# Altium schematic sheet Sch_Design_Check_List.SchDoc
size A4; SheetNumber: 11; SheetTotal: 10
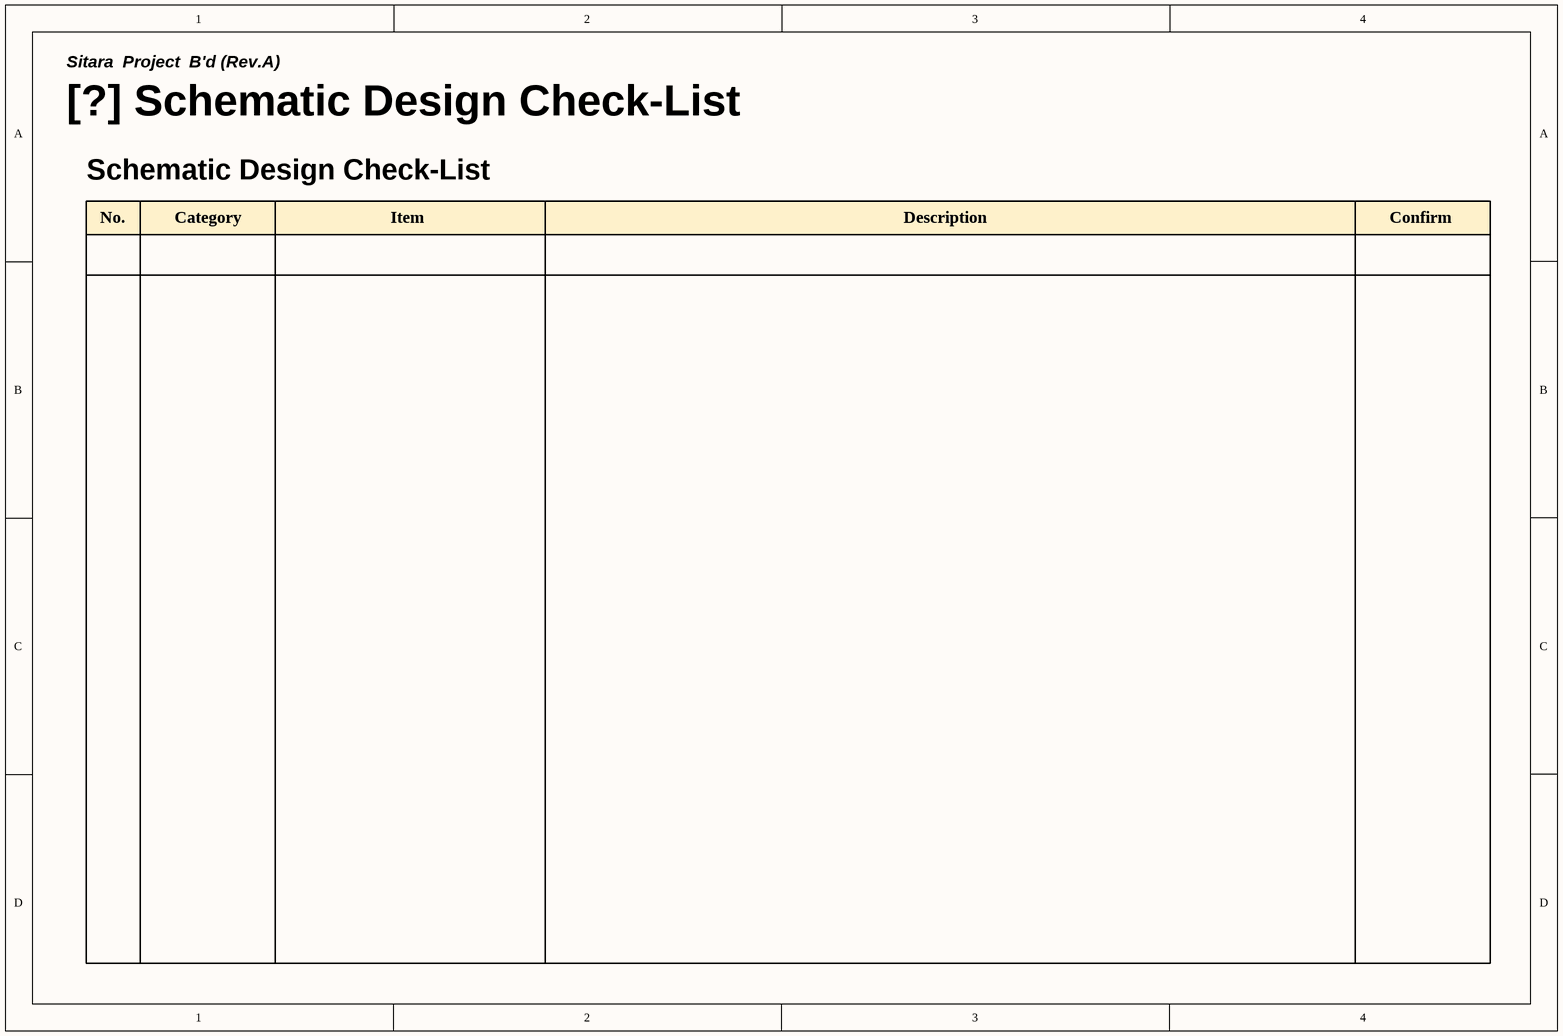
[diagram p0: Sch_Design_Check_List.SchDoc]

## Notes on the sheet
- Sitara  Project  B'd (Rev.A)
- [?] Schematic Design Check-List
- Schematic Design Check-List
- No.
- Category
- Item
- Description
- Confirm
- Title
- Rev
- Doc
- Sheet #
- of
- Engineer
- This document is copyright of ArkX and shall not be revealed, produced, copied, in whole or in part,
- Date
- nor used for any purpose other than submitted.